# Altium project sd_card_module.PrjPcb
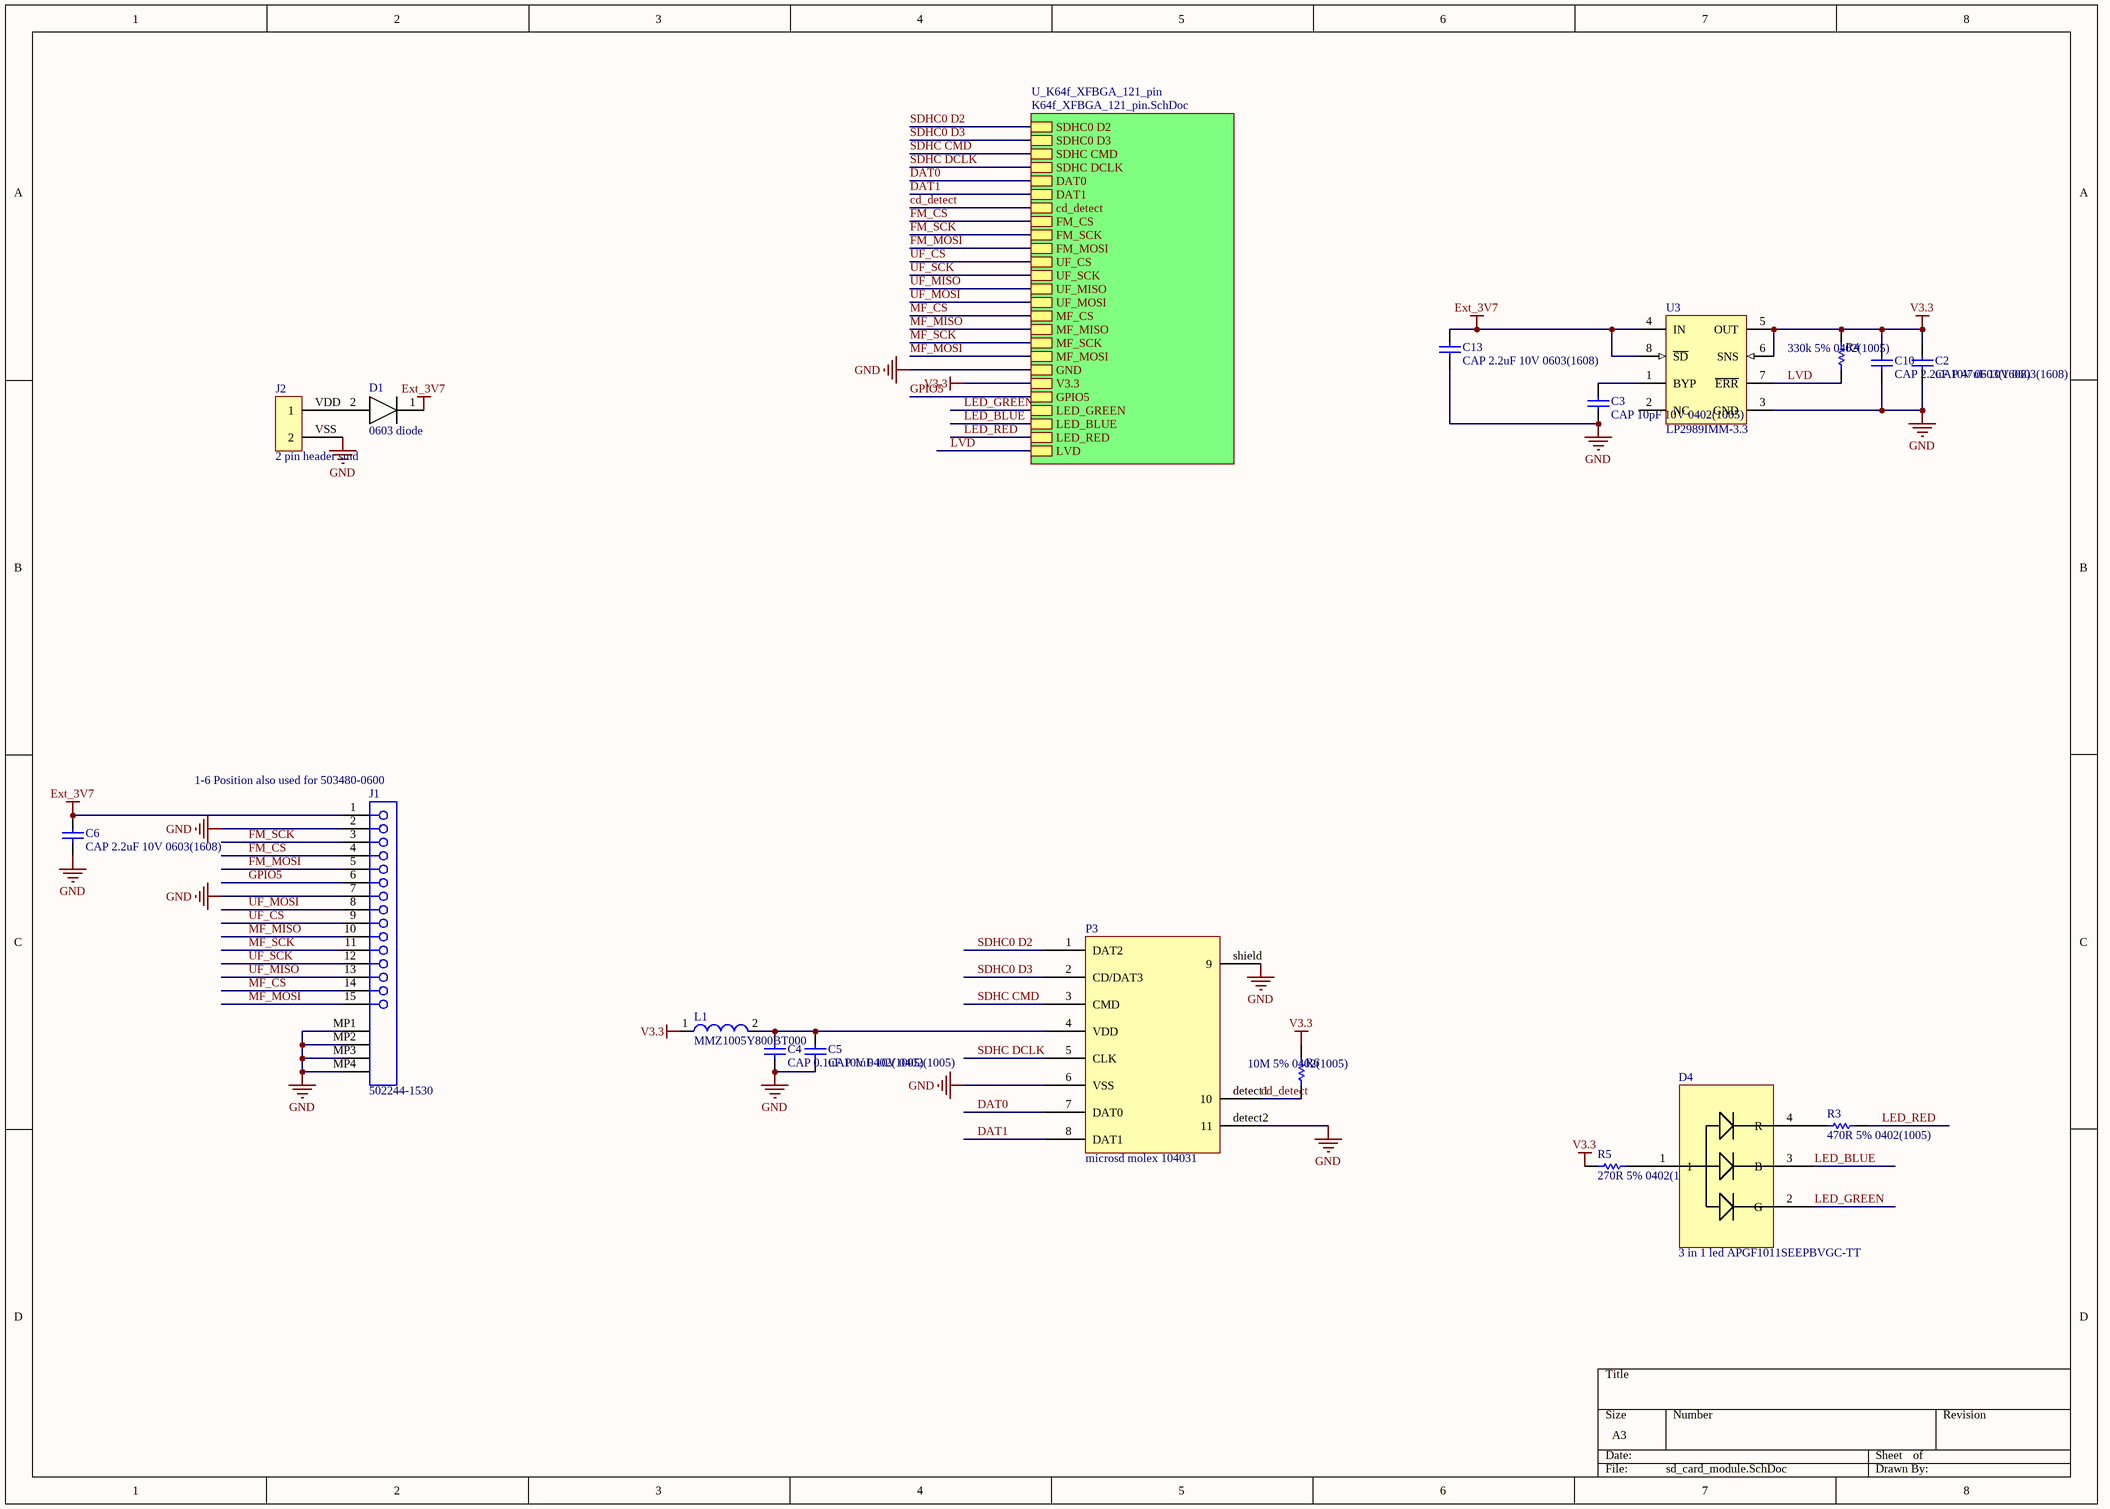
[diagram p0: sd_card_module.SchDoc]
2 sheets, 26 parts. Net scope: hierarchical (ports join the sheet entries above them; power ports are global).
Board file: sd_card_module.PcbDoc
Sheets:
  sd_card_module.SchDoc
    U_K64f_XFBGA_121_pin = K64f_XFBGA_121_pin.SchDoc

## Sheet sd_card_module.SchDoc
size A3

### Parts
C2  CAP 47uF 10V 0603(1608)  [CAPC0603(1608)100_M]
C3  CAP 10pF 10V 0402(1005)  [CAPC0402(1005)60_M]
C4  CAP 0.1uF 10V 0402(1005)  [CAPC0402(1005)60_M]
C5  CAP 1uF 10V 0402(1005)  [CAPC0402(1005)60_M]
C6  CAP 2.2uF 10V 0603(1608)  [CAPC0603(1608)100_M]
C10  CAP 2.2uF 10V 0603(1608)  [CAPC0603(1608)100_M]
C13  CAP 2.2uF 10V 0603(1608)  [CAPC0603(1608)100_M]
D1  0603 diode  [DIOC0603X03N]
D4  3 in 1 led APGF1011SEEPBVGC-TT  [APGF1011SEEPBVGC-TT]
J1  502244-1530  [MOLX-502244-1530 long_pins]
J2  2 pin header smd  [2 pin header picolock]
L1  MMZ1005Y800BT000  [SMD-0402]
P3  microsd molex 104031  [MICROSD 104031 molex]
R3  470R 5% 0402(1005)  [RESC0402(1005)_L]
R4  330k 5% 0402(1005)  [RESC0402(1005)_L]
R5  270R 5% 0402(1005)  [RESC0402(1005)_L]
R6  10M 5% 0402(1005)  [RESC0402(1005)_L]
U3  LP2989IMM-3.3  [MUA08A_L]

### Sub-sheets
U_K64f_XFBGA_121_pin = K64f_XFBGA_121_pin.SchDoc: SDHC0 D2, SDHC0 D3, SDHC CMD, SDHC DCLK, DAT0, DAT1, cd_detect, FM_CS, FM_SCK, FM_MOSI, UF_CS, UF_SCK, UF_MISO, UF_MOSI, MF_CS, MF_MISO, MF_SCK, MF_MOSI, GND, V3.3, GPIO5, LED_GREEN, LED_BLUE, LED_RED, LVD

### Nets
Ext_3V7: C6.2 C13.2 D1.1 J1.1 U3.4(IN) U3.8(~{SD})
GND: C2.1 C3.1 C4.1 C5.1 C6.1 C10.1 C13.1 J1.2 J1.7 J1.MP1 J1.MP2 J1.MP3 J1.MP4 J2.VSS(2) P3.6(VSS) P3.detect2(11) P3.shield(9) U3.3(GND) ; sheet U_K64f_XFBGA_121_pin/GND
V3.3: C2.2 C10.2 L1.1 R4.1 R5.1 R6.1 U3.5(OUT) U3.6(SNS) ; sheet U_K64f_XFBGA_121_pin/V3.3
cd_detect: P3.detect1(10) R6.2 ; sheet U_K64f_XFBGA_121_pin/cd_detect
DAT0: P3.7(DAT0) ; sheet U_K64f_XFBGA_121_pin/DAT0
DAT1: P3.8(DAT1) ; sheet U_K64f_XFBGA_121_pin/DAT1
FM_CS: J1.4 ; sheet U_K64f_XFBGA_121_pin/FM_CS
FM_MOSI: J1.5 ; sheet U_K64f_XFBGA_121_pin/FM_MOSI
FM_SCK: J1.3 ; sheet U_K64f_XFBGA_121_pin/FM_SCK
GPIO5: J1.6 ; sheet U_K64f_XFBGA_121_pin/GPIO5
LED_BLUE: D4.3(B) ; sheet U_K64f_XFBGA_121_pin/LED_BLUE
LED_GREEN: D4.2(G) ; sheet U_K64f_XFBGA_121_pin/LED_GREEN
LED_RED: R3.2 ; sheet U_K64f_XFBGA_121_pin/LED_RED
LVD: R4.2 U3.7(~{ERR}) ; sheet U_K64f_XFBGA_121_pin/LVD
MF_CS: J1.14 ; sheet U_K64f_XFBGA_121_pin/MF_CS
MF_MISO: J1.10 ; sheet U_K64f_XFBGA_121_pin/MF_MISO
MF_MOSI: J1.15 ; sheet U_K64f_XFBGA_121_pin/MF_MOSI
MF_SCK: J1.11 ; sheet U_K64f_XFBGA_121_pin/MF_SCK
SDHC0 D2: P3.1(DAT2) ; sheet U_K64f_XFBGA_121_pin/SDHC0 D2
SDHC0 D3: P3.2(CD/DAT3) ; sheet U_K64f_XFBGA_121_pin/SDHC0 D3
SDHC CMD: P3.3(CMD) ; sheet U_K64f_XFBGA_121_pin/SDHC CMD
SDHC DCLK: P3.5(CLK) ; sheet U_K64f_XFBGA_121_pin/SDHC DCLK
UF_CS: J1.9 ; sheet U_K64f_XFBGA_121_pin/UF_CS
UF_MISO: J1.13 ; sheet U_K64f_XFBGA_121_pin/UF_MISO
UF_MOSI: J1.8 ; sheet U_K64f_XFBGA_121_pin/UF_MOSI
UF_SCK: J1.12 ; sheet U_K64f_XFBGA_121_pin/UF_SCK
NetC3_2: C3.2 U3.1(BYP)
NetC4_2: C4.2 C5.2 L1.2 P3.4(VDD)
NetD1_2: D1.2 J2.VDD(1)
NetD4_1: D4.1 R5.2
NetD4_4: D4.4(R) R3.1

Not connected (* = marked no-connect by the designer): U3 2(NC)

### Notes on the sheet
- (near J1) 1-6 Position also used for 503480-0600

### Library data of the parts
C2 = CMP-1035-00147-1: CAP 47uF 10V ±0.1pF 0603 (1608 Metric) Thickness 1mm SMD; Case-Metric: 1608; Case-EIA: 0603; Tolerance: Â±0.1pF; Max Thickness: 1 mm; Rated Voltage: 10 V; Value: 47uF; Technology: SMT
C3 = CMP-1034-00013-1: CAP 10pF 10V ±0.1pF 0402 (1005 Metric) Thickness 0.6mm SMD; Case-Metric: 1005; Tolerance: Â±0.1pF; Case-EIA: 0402; Value: 10pF; Max Thickness: 0.6 mm; Rated Voltage: 10 V; Technology: SMT
C4 = CMP-1034-00013-1: CAP 0.5pF 10V ±0.1uF 0402 (1005 Metric) Thickness 0.6mm SMD; Case-Metric: 1005; Tolerance: Â±0.1pF; Case-EIA: 0402; Value: 0.1uF; Max Thickness: 0.6 mm; Rated Voltage: 10 V; Technology: SMT
C5 = CMP-1034-00013-1: CAP 1uF 10V ±1uF 0402 (1005 Metric) Thickness 0.6mm SMD; Case-Metric: 1005; Tolerance: Â±0.1pF; Case-EIA: 0402; Value: 1uF; Max Thickness: 0.6 mm; Rated Voltage: 10 V; Technology: SMT
C6 C10 C13 = CMP-1035-00147-1: CAP 2.2uF 10V ±0.1pF 0603 (1608 Metric) Thickness 1mm SMD; Case-Metric: 1608; Case-EIA: 0603; Tolerance: Â±0.1pF; Max Thickness: 1 mm; Rated Voltage: 10 V; Value: 2.2uF; Technology: SMT
J1 = MOLX-502244-1530
L1 = CMP-0220-00098-1: EMI Filter Beads, Chips & Arrays 0402 80ohms 250mA HiSpd Signal Line; Impedance: 20 Ohm; ComponentLink2URL: http://www.we-online.de/katalog/media/pdf/74279273.pdf; DatasheetVersion: ver 6, Jul-2009; PackageVersion: 2009; PackageDescription: Chip Inductor, 2-Leads, Body 1.0 x 0.5 mm; ComponentLink1URL: http://www.we-online.com; ComponentLink2Description: Datasheet; PackageReference: SMD-0402; ComponentLink1Description: Manufacturer Link
R3 = CMP-1011-00090-1: 470R 5% 0402 (1005 Metric)  SMD; Value: 470.00 Ohm; Case-Metric: 1005; Power: 0.063 W; Case-EIA: 0402; Tolerance: 5 %; Technology: SMT
R4 = CMP-1011-00090-1: 330k 0.063W 5% 0402 (1005 Metric)  SMD; Case-Metric: 1005; Case-EIA: 0402; Tolerance: 5 %; Value: 330k; Power: 0.063 W; Technology: SMT
R5 = CMP-1011-00090-1: 270R W 5% 0402 (1005 Metric)  SMD; Value: 270; Case-Metric: 1005; Power: 0.063 W; Case-EIA: 0402; Tolerance: 5 %; Technology: SMT
R6 = CMP-1011-00090-1: 10M 0.063W 5% 0402 (1005 Metric)  SMD; Case-Metric: 1005; Case-EIA: 0402; Tolerance: 5 %; Value: 10M; Power: 0.063 W; Technology: SMT
U3 = CMP-0062-02283-2: Micropower/Low Noise, 500 mA Ultra Low-Dropout Regulator, 8-pin Mini SOIC; Manufacturer: National Semiconductor; PackageTopMarking: ZXTT*LA2B; PowerWise: N; CompType: LDO IC; RevisionNote: Component URLs added; ComponentLink2URL: http://www.national.com/pf/LP/LP2989.html; DatasheetVersion: Feb-2005; PackageVersion: revF, Apr-2008; PackageReference: MUA08A; ComponentLink3Description: MUA08A Package Page; PackageDescription: MINI SOIC, .118 x .118 x .034in, 8 Lead, .0256in Pitch; RoHS: N; ComponentLink2Description: LP2989 Web Page; Code_JEDEC: MO-187-AA; ComponentLink3URL: http://www.national.com/packaging/folders/mua08a.html; PinCount: 8; ComponentLink1Description: LP2989 Datasheet; ComponentLink1URL: http://www.national.com/ds/LP/LP2989.pdf

## Sheet K64f_XFBGA_121_pin.SchDoc
size A3
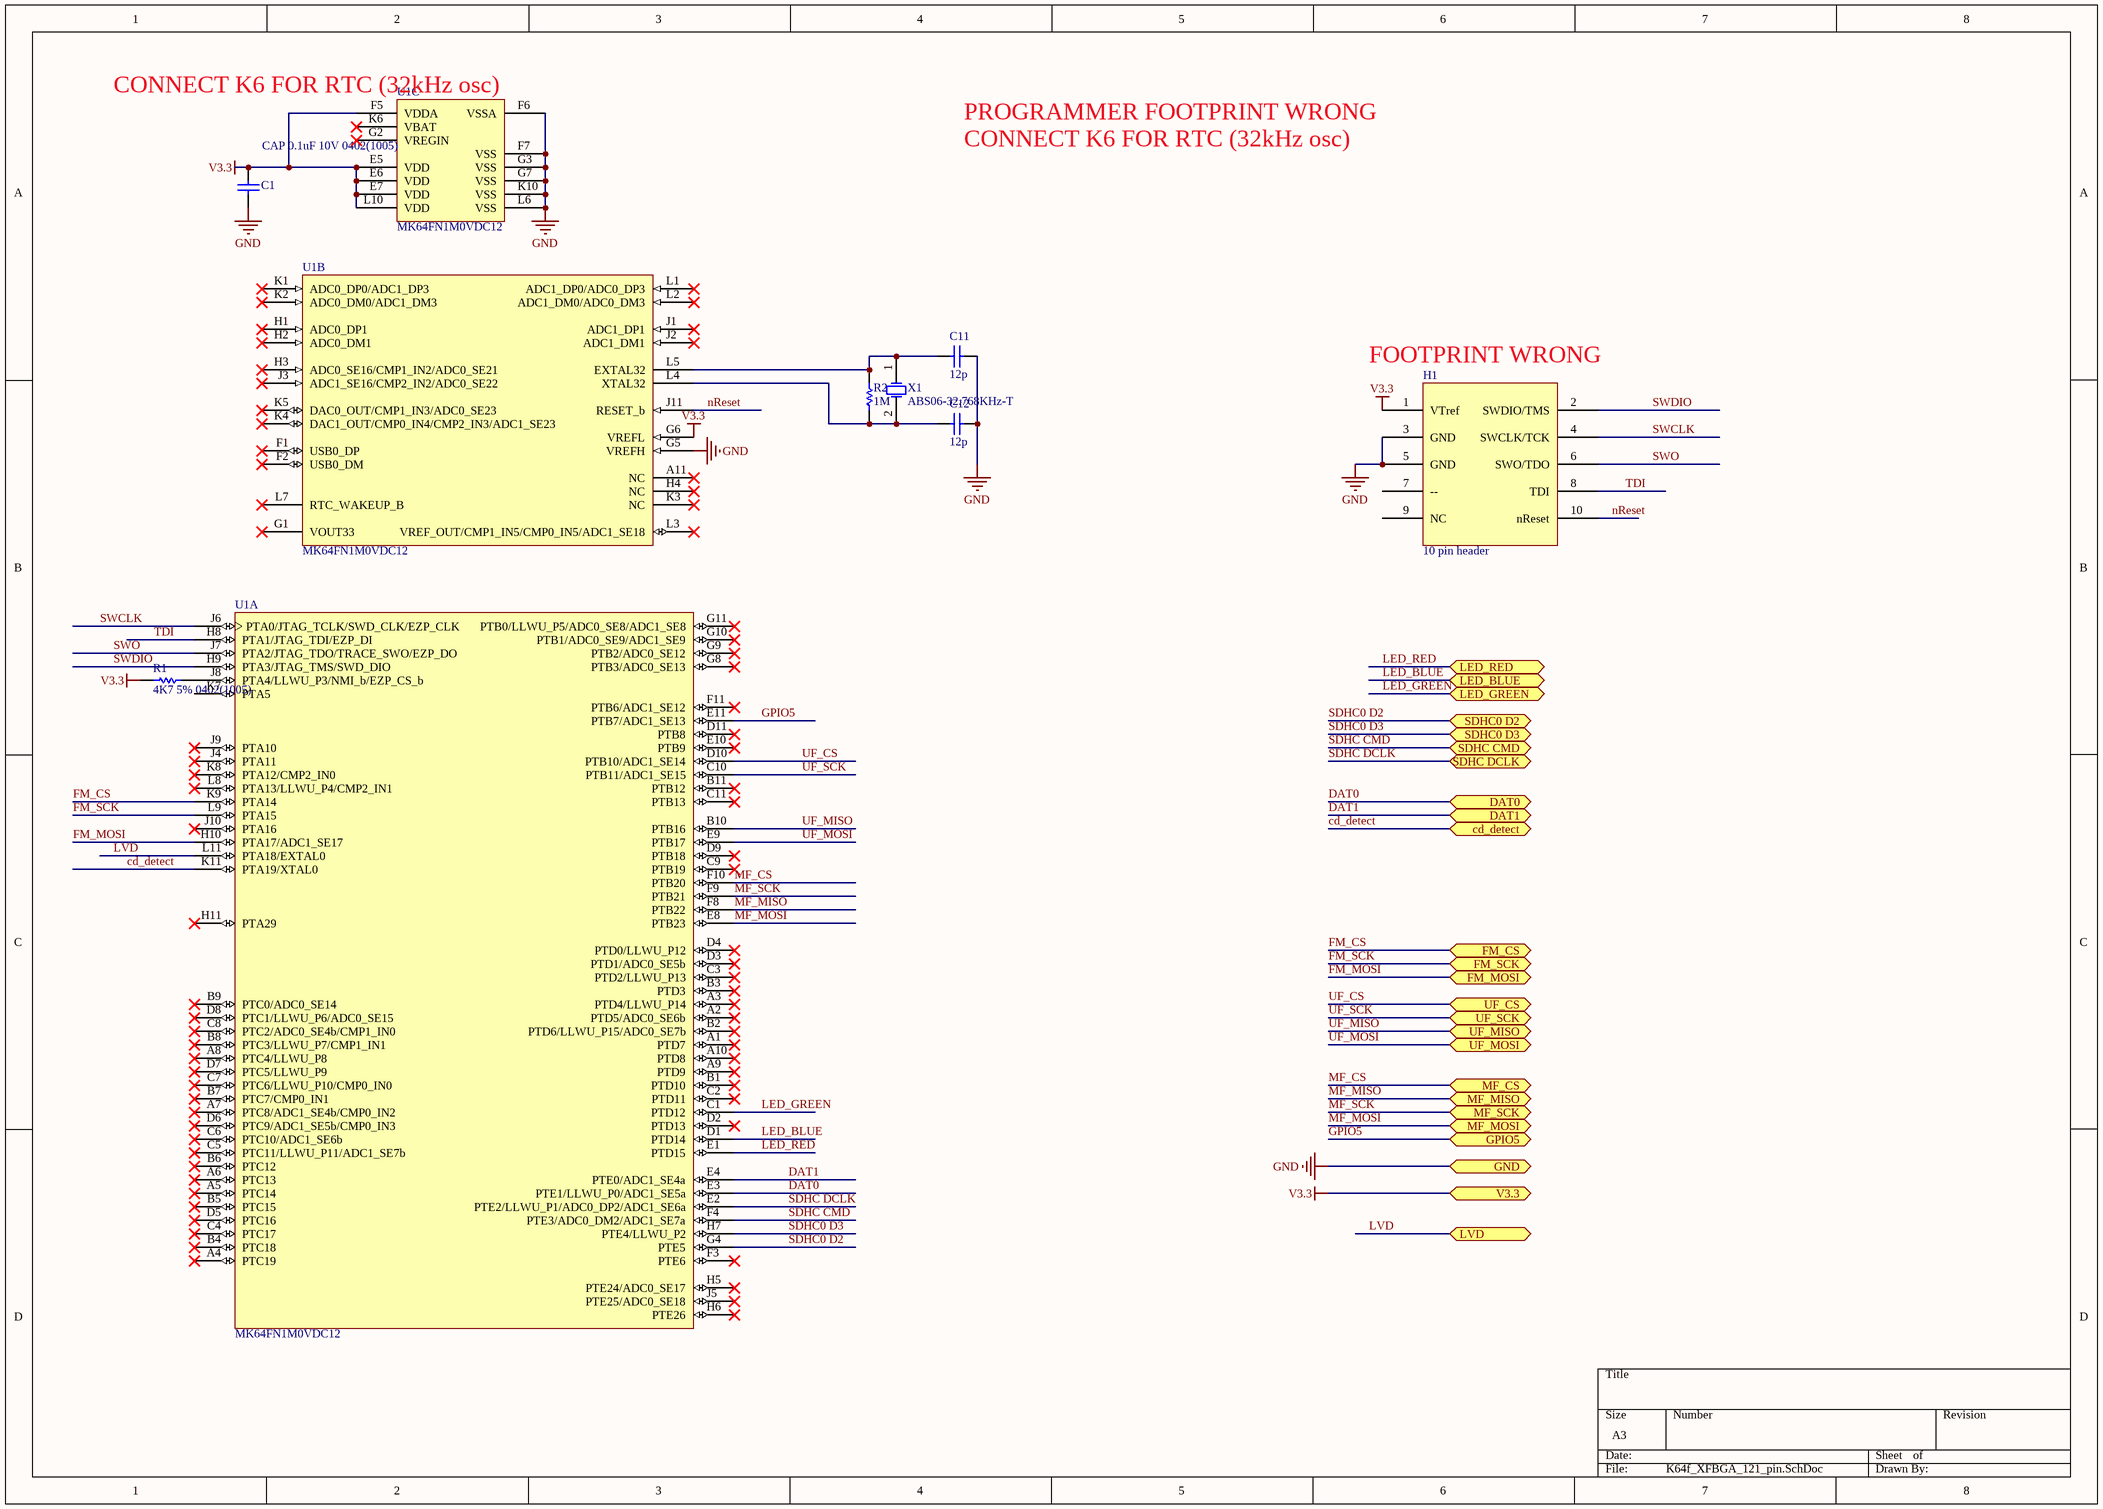
[diagram p1: K64f_XFBGA_121_pin.SchDoc]

### Parts
C1  CAP 0.1uF 10V 0402(1005)  [CAPC0402(1005)60_M]
C11  12p  [CAPC0402(1005)60_M]
C12  12p  [CAPC0402(1005)60_M]
H1  10 pin header  [SAM8795-ND]
R1  4K7 5% 0402(1005)  [RESC0402(1005)_L]
R2  1M  [RESC0402(1005)_L]
U1  MK64FN1M0VDC12  [FRES-MAPBGA-121]  (parts A,B,C of 3)
X1  ABS06-32.768KHz-T  [0805]

### Ports
cd_detect, DAT0, DAT1, FM_CS, FM_MOSI, FM_SCK, GND, GPIO5, LED_BLUE, LED_GREEN, LED_RED, LVD, MF_CS, MF_MISO, MF_MOSI, MF_SCK, SDHC0 D2, SDHC0 D3, SDHC CMD, SDHC DCLK, UF_CS, UF_MISO, UF_MOSI, UF_SCK, V3.3

### Nets
GND: C1.1 C11.1 C12.1 H1.3(GND) H1.5(GND) U1.F6(VSSA) U1.F7(VSS) U1.G3(VSS) U1.G5(VREFH) U1.G7(VSS) U1.K10(VSS) U1.L6(VSS) ; port GND
V3.3: C1.2 H1.1(VTref) R1.1 U1.E5(VDD) U1.E6(VDD) U1.E7(VDD) U1.F5(VDDA) U1.G6(VREFL) U1.L10(VDD) ; port V3.3
cd_detect: U1.K11(PTA19/XTAL0) ; port cd_detect
DAT0: U1.E3(PTE1/LLWU_P0/ADC1_SE5a) ; port DAT0
DAT1: U1.E4(PTE0/ADC1_SE4a) ; port DAT1
FM_CS: U1.K9(PTA14) ; port FM_CS
FM_MOSI: U1.H10(PTA17/ADC1_SE17) ; port FM_MOSI
FM_SCK: U1.L9(PTA15) ; port FM_SCK
GPIO5: U1.E11(PTB7/ADC1_SE13) ; port GPIO5
LED_BLUE: U1.D1(PTD14) ; port LED_BLUE
LED_GREEN: U1.C1(PTD12) ; port LED_GREEN
LED_RED: U1.E1(PTD15) ; port LED_RED
LVD: U1.L11(PTA18/EXTAL0) ; port LVD
MF_CS: U1.F10(PTB20) ; port MF_CS
MF_MISO: U1.F8(PTB22) ; port MF_MISO
MF_MOSI: U1.E8(PTB23) ; port MF_MOSI
MF_SCK: U1.F9(PTB21) ; port MF_SCK
nReset: H1.10(nReset) U1.J11(RESET_b)
SDHC0 D2: U1.G4(PTE5) ; port SDHC0 D2
SDHC0 D3: U1.H7(PTE4/LLWU_P2) ; port SDHC0 D3
SDHC CMD: U1.F4(PTE3/ADC0_DM2/ADC1_SE7a) ; port SDHC CMD
SDHC DCLK: U1.E2(PTE2/LLWU_P1/ADC0_DP2/ADC1_SE6a) ; port SDHC DCLK
SWCLK: H1.4(SWCLK/TCK) U1.J6(PTA0/JTAG_TCLK/SWD_CLK/EZP_CLK)
SWDIO: H1.2(SWDIO/TMS) U1.H9(PTA3/JTAG_TMS/SWD_DIO)
SWO: H1.6(SWO/TDO) U1.J7(PTA2/JTAG_TDO/TRACE_SWO/EZP_DO)
TDI: H1.8(TDI) U1.H8(PTA1/JTAG_TDI/EZP_DI)
UF_CS: U1.D10(PTB10/ADC1_SE14) ; port UF_CS
UF_MISO: U1.B10(PTB16) ; port UF_MISO
UF_MOSI: U1.E9(PTB17) ; port UF_MOSI
UF_SCK: U1.C10(PTB11/ADC1_SE15) ; port UF_SCK
NetC11_2: C11.2 R2.1 U1.L5(EXTAL32) X1.1(X1)
NetC12_2: C12.2 R2.2 U1.L4(XTAL32) X1.2(X2)
NetR1_2: R1.2 U1.J8(PTA4/LLWU_P3/NMI_b/EZP_CS_b)

Not connected (* = marked no-connect by the designer): H1 7(--) 9(NC); U1 A1(PTD7)* A2(PTD5/ADC0_SE6b)* A3(PTD4/LLWU_P14)* A4(PTC19)* A5(PTC14)* A6(PTC13)* A7(PTC8/ADC1_SE4b/CMP0_IN2)* A8(PTC4/LLWU_P8)* A9(PTD9)* A10(PTD8)* A11(NC)* B1(PTD10)* B2(PTD6/LLWU_P15/ADC0_SE7b)* B3(PTD3)* B4(PTC18)* B5(PTC15)* B6(PTC12)* B7(PTC7/CMP0_IN1)* B8(PTC3/LLWU_P7/CMP1_IN1)* B9(PTC0/ADC0_SE14)* B11(PTB12)* C2(PTD11)* C3(PTD2/LLWU_P13)* C4(PTC17)* C5(PTC11/LLWU_P11/ADC1_SE7b)* C6(PTC10/ADC1_SE6b)* C7(PTC6/LLWU_P10/CMP0_IN0)* C8(PTC2/ADC0_SE4b/CMP1_IN0)* C9(PTB19)* C11(PTB13)* D2(PTD13)* D3(PTD1/ADC0_SE5b)* D4(PTD0/LLWU_P12)* D5(PTC16)* D6(PTC9/ADC1_SE5b/CMP0_IN3)* D7(PTC5/LLWU_P9)* D8(PTC1/LLWU_P6/ADC0_SE15)* D9(PTB18)* D11(PTB8)* E10(PTB9)* F1(USB0_DP)* F2(USB0_DM)* F3(PTE6)* F11(PTB6/ADC1_SE12)* G1(VOUT33)* G2(VREGIN)* G8(PTB3/ADC0_SE13)* G9(PTB2/ADC0_SE12)* G10(PTB1/ADC0_SE9/ADC1_SE9)* G11(PTB0/LLWU_P5/ADC0_SE8/ADC1_SE8)* H1(ADC0_DP1)* H2(ADC0_DM1)* H3(ADC0_SE16/CMP1_IN2/ADC0_SE21)* H4(NC)* H5(PTE24/ADC0_SE17)* H6(PTE26)* H11(PTA29)* J1(ADC1_DP1)* J2(ADC1_DM1)* J3(ADC1_SE16/CMP2_IN2/ADC0_SE22)* J4(PTA11)* J5(PTE25/ADC0_SE18)* J9(PTA10)* J10(PTA16)* K1(ADC0_DP0/ADC1_DP3)* K2(ADC0_DM0/ADC1_DM3)* K3(NC)* K4(DAC1_OUT/CMP0_IN4/CMP2_IN3/ADC1_SE23)* K5(DAC0_OUT/CMP1_IN3/ADC0_SE23)* K6(VBAT)* K7(PTA5) K8(PTA12/CMP2_IN0)* L1(ADC1_DP0/ADC0_DP3)* L2(ADC1_DM0/ADC0_DM3)* L3(VREF_OUT/CMP1_IN5/CMP0_IN5/ADC1_SE18)* L7(RTC_WAKEUP_B)* L8(PTA13/LLWU_P4/CMP2_IN1)*

### Notes on the sheet
- (near U1) CONNECT K6 FOR RTC (32kHz osc)
- PROGRAMMER FOOTPRINT WRONG
- CONNECT K6 FOR RTC (32kHz osc)
- (near H1) FOOTPRINT WRONG

### Library data of the parts
C1 = CMP-1034-00013-1: 0.1uF; Case-Metric: 1005; Tolerance: Â±0.1pF; Case-EIA: 0402; Value: 0.1uF; Max Thickness: 0.6 mm; Rated Voltage: 10 V; Technology: SMT
C11 C12 = CMP-1034-00013-1: CAP 12pF 10V ±0.1pF 0402 (1005 Metric) Thickness 0.6mm SMD; Value: 0.5pF; Case-Metric: 1005; Tolerance: Â±0.1pF; Case-EIA: 0402; Max Thickness: 0.6 mm; Rated Voltage: 10 V; Technology: SMT
H1 = SAM8795-ND: 10 pin programming header SAM8795-ND
R1 = CMP-1011-00090-1: 4K7 0.063W 5% 0402 (1005 Metric)  SMD; Value: 4700.00 Ohm; Case-Metric: 1005; Case-EIA: 0402; Tolerance: 5 %; Power: 0.063 W; Technology: SMT
R2 = CMP-1011-00090-1: 1M 0.063W 5% 0402 (1005 Metric)  SMD; Value: 4700.00 Ohm; Case-Metric: 1005; Case-EIA: 0402; Tolerance: 5 %; Power: 0.063 W; Technology: SMT
U1 = CMP-0182-00050-2: Cortex-M4-based Microcontroller with FPU, 1 MB, 120 MHz, 1.71 to 3.6 V, -40 to 105 degC, 121-Ball MAPBGA, RoHS, Tray; Manufacturer: Freescale Semiconductor; SRAM: 256 KB; Flash: 1 MB; ComponentLink3URL: http://cache.freescale.com/files/shared/doc/package_info/98ASA00595D.pdf; PackageDescription: 121-Ball Mold Array Process Ball Grid Array, Body 8 x 8 mm, Pitch 0.65 mm; ComponentLink3Description: Package Specification; ComponentLink1URL: http://www.freescale.com/; Temperature Range: -40 to 105 degC; DatasheetVersion: Rev. 3; Packing: Tray; VDD: 1.71 to 3.6 V; ComponentLink2URL: http://cache.freescale.com/files/microcontrollers/doc/data_sheet/K64P144M120SF5.pdf?pspll=1; Mounting Technology: Surface Mount; VBAT: 1.71 to 3.6 V; ComponentLink1Description: Manufacturer URL; VDDA: 1.71 to 3.6 V; ComponentLink2Description: Datasheet; RoHS: TRUE; PackageVersion: Rev. O; PartNumber: MK64FN1M0VDC12; PartId: 1
X1 = CMP-0463-00001-2: Crystals 32.768KHz 20ppm 12.5pF -40C +85C 0805(2012); PartNumber: 14340272-32.768KHz; Manufacturer: ITTI; Frequency Tolerance: +/-20 ppm; Drive Level: 1 max. uw; Nominal Frequency: 32.768KHz; Mounting Technology: Surface Mount; Operating temperature: -40 to 85 degC; ComponentLink1URL: http://www.itti-co.com; Load Capacitance: 12.5 pF; ComponentLink1Description: Manufacturer URL; PackageReference: 14340272-32.768KHz-2; PackageDescription: 2-Pin Hand Drawn, Body 3.2 x 1.5mm, Pitch 2.5 mm

## Nets that join several sheets
GND: sd_card_module (18 pins), K64f_XFBGA_121_pin (12 pins)
V3.3: sd_card_module (8 pins), K64f_XFBGA_121_pin (9 pins)
cd_detect: sd_card_module (P3.detect1 R6.2), K64f_XFBGA_121_pin (U1.K11)
DAT0: sd_card_module (P3.7), K64f_XFBGA_121_pin (U1.E3)
DAT1: sd_card_module (P3.8), K64f_XFBGA_121_pin (U1.E4)
FM_CS: sd_card_module (J1.4), K64f_XFBGA_121_pin (U1.K9)
FM_MOSI: sd_card_module (J1.5), K64f_XFBGA_121_pin (U1.H10)
FM_SCK: sd_card_module (J1.3), K64f_XFBGA_121_pin (U1.L9)
GPIO5: sd_card_module (J1.6), K64f_XFBGA_121_pin (U1.E11)
LED_BLUE: sd_card_module (D4.3), K64f_XFBGA_121_pin (U1.D1)
LED_GREEN: sd_card_module (D4.2), K64f_XFBGA_121_pin (U1.C1)
LED_RED: sd_card_module (R3.2), K64f_XFBGA_121_pin (U1.E1)
LVD: sd_card_module (R4.2 U3.7), K64f_XFBGA_121_pin (U1.L11)
MF_CS: sd_card_module (J1.14), K64f_XFBGA_121_pin (U1.F10)
MF_MISO: sd_card_module (J1.10), K64f_XFBGA_121_pin (U1.F8)
MF_MOSI: sd_card_module (J1.15), K64f_XFBGA_121_pin (U1.E8)
MF_SCK: sd_card_module (J1.11), K64f_XFBGA_121_pin (U1.F9)
SDHC0 D2: sd_card_module (P3.1), K64f_XFBGA_121_pin (U1.G4)
SDHC0 D3: sd_card_module (P3.2), K64f_XFBGA_121_pin (U1.H7)
SDHC CMD: sd_card_module (P3.3), K64f_XFBGA_121_pin (U1.F4)
SDHC DCLK: sd_card_module (P3.5), K64f_XFBGA_121_pin (U1.E2)
UF_CS: sd_card_module (J1.9), K64f_XFBGA_121_pin (U1.D10)
UF_MISO: sd_card_module (J1.13), K64f_XFBGA_121_pin (U1.B10)
UF_MOSI: sd_card_module (J1.8), K64f_XFBGA_121_pin (U1.E9)
UF_SCK: sd_card_module (J1.12), K64f_XFBGA_121_pin (U1.C10)